# Altium schematic sheet WL-DAC.SchDoc
size 420 x 297 mm; Address1: Address1; Address2: Address2; Address3: Address3; Address4: Address4; DocumentNumber: ТРАНСИВЕР «ВОЛК»; SheetNumber: 5; Scale: 1:1; FirstReferrence: WOLF
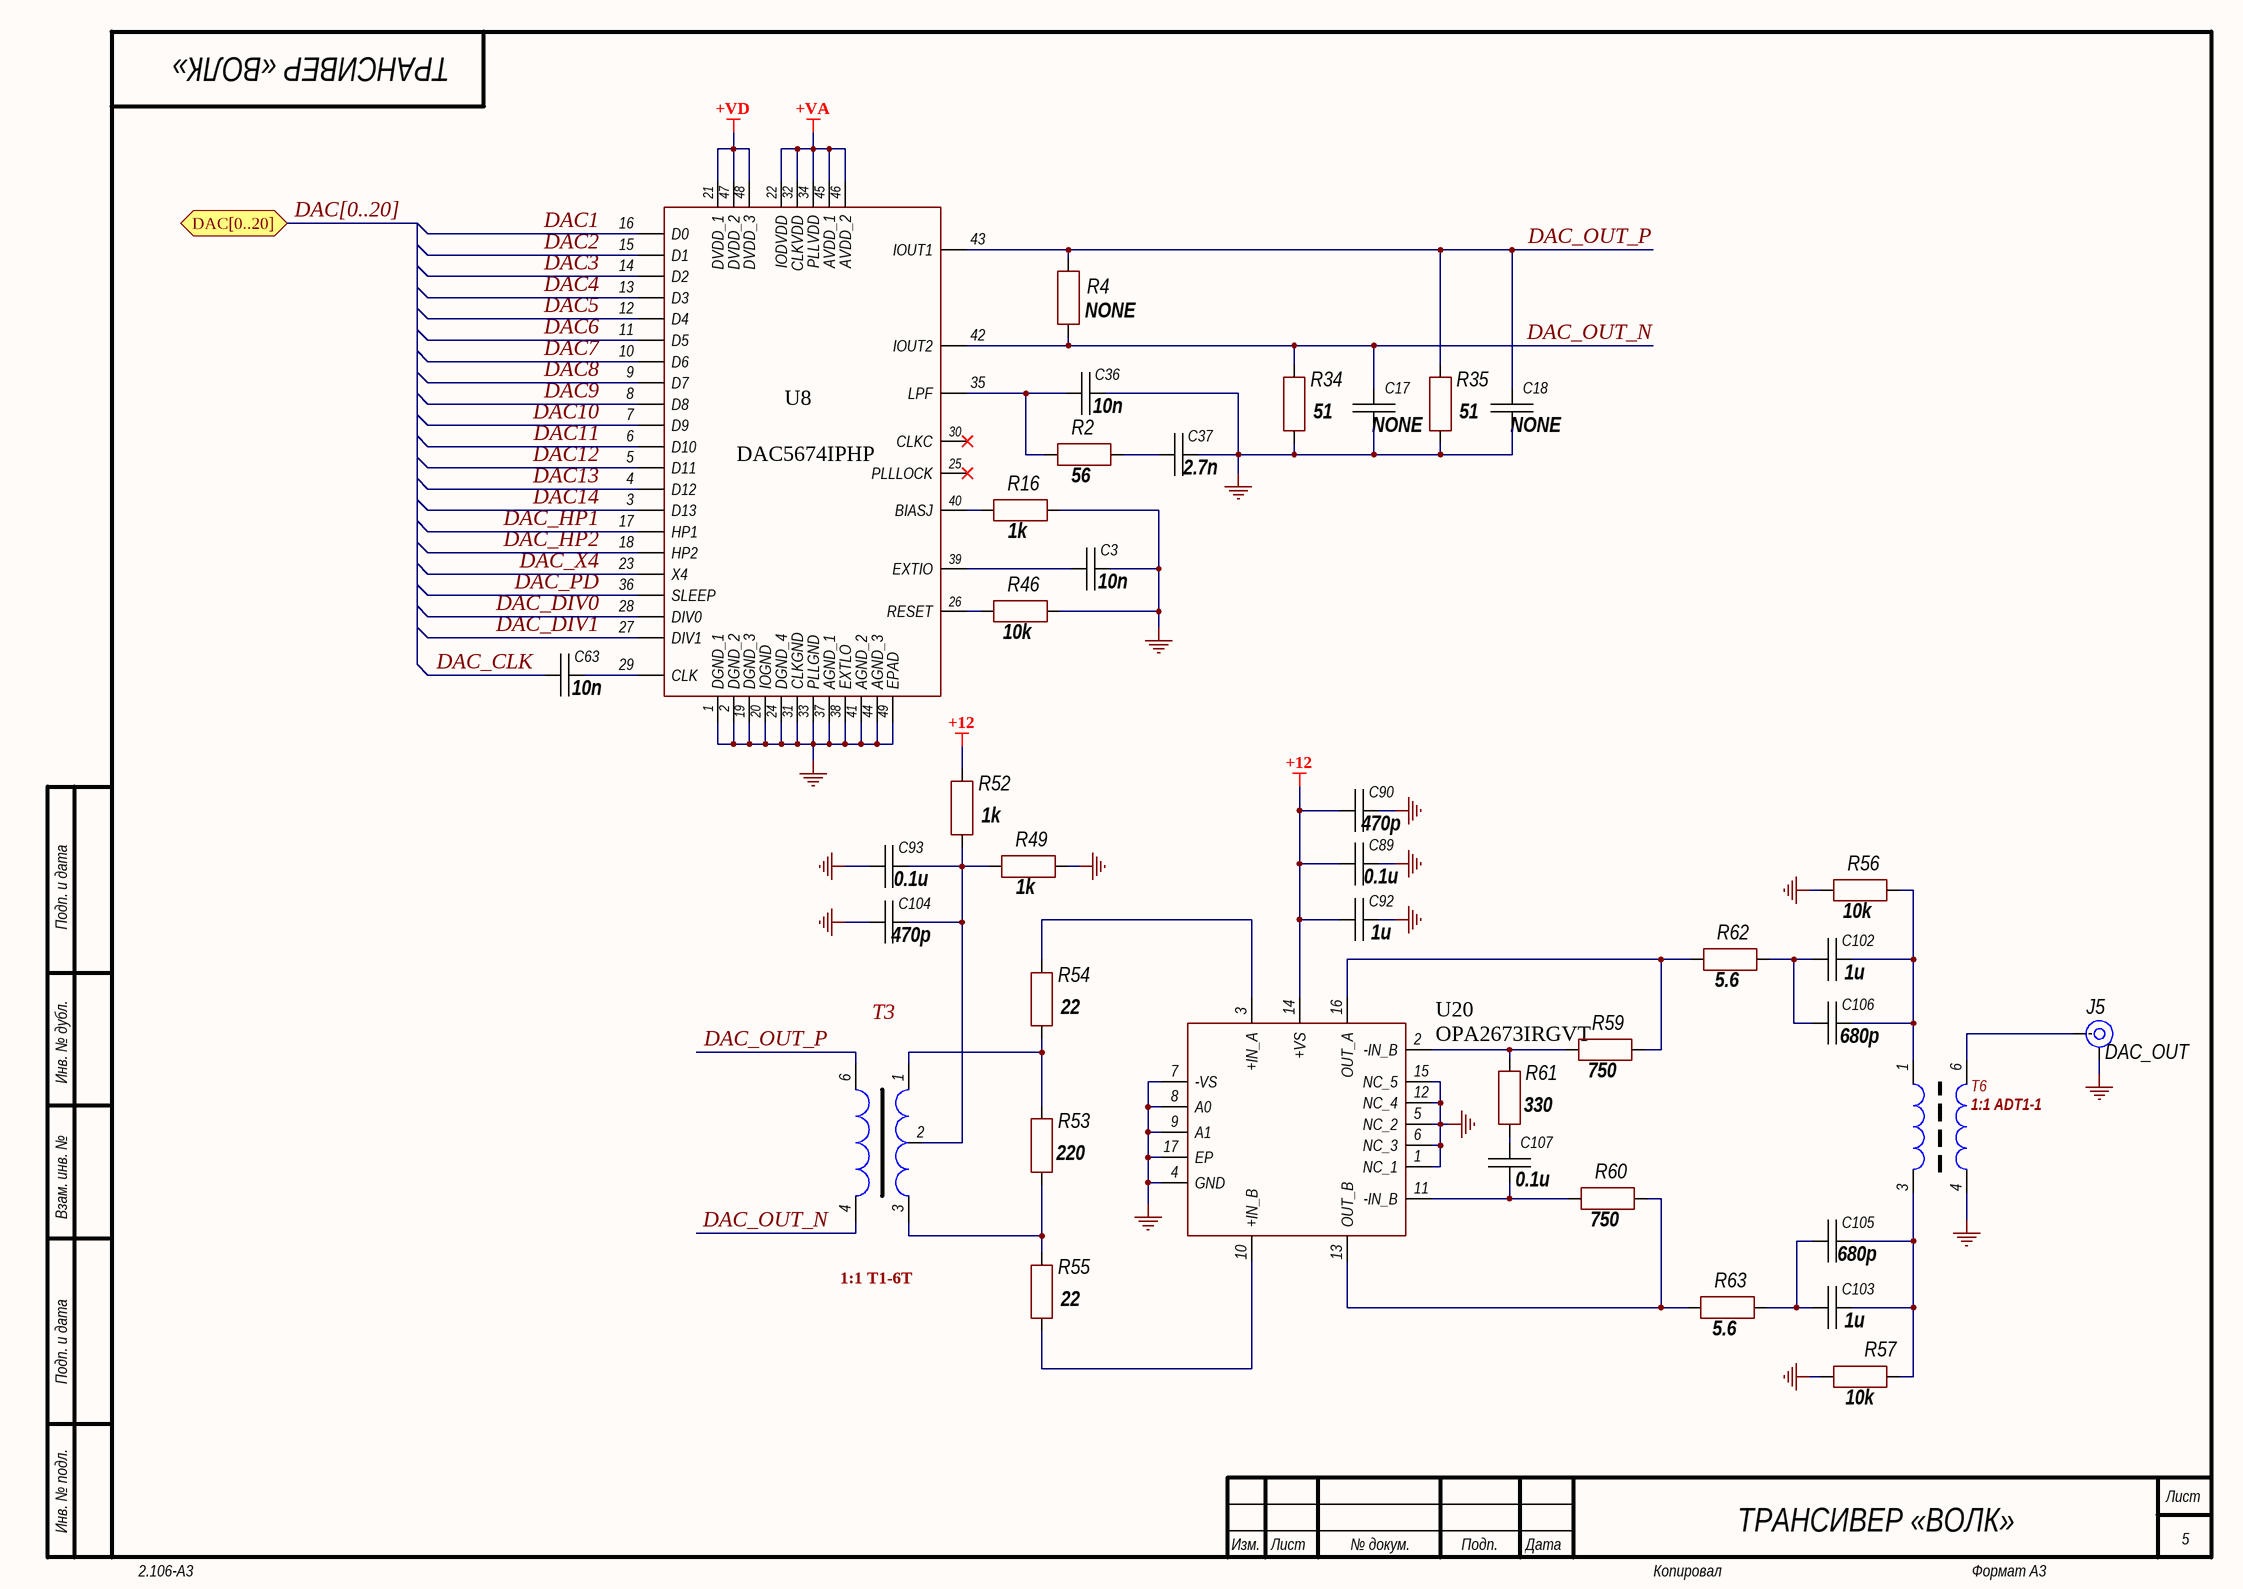
[diagram p0: WL-DAC.SchDoc]

## Parts
C3  10n  [CH0805C]
C17  NONE  [CH0805C]
C18  NONE  [CH0805C]
C36  10n  [CH0805C]
C37  2.7n  [CH0805C]
C63  10n  [CH0805C]
C89  0.1u  [CH0805C]
C90  470p  [CH0805C]
C92  1u  [CH0805C]
C93  0.1u  [CH0805C]
C102  1u  [CH0805C]
C103  1u  [CH0805C]
C104  470p  [CH0805C]
C105  680p  [CH0805C]
C106  680p  [CH0805C]
C107  0.1u  [CH0805C]
J5  DAC_OUT  [CON: SMA]
R2  56  [CH0805R]
R4  NONE  [CH0805R]
R16  1k  [CH0805R]
R34  51  [CH0805R]
R35  51  [CH0805R]
R46  10k  [CH0805R]
R49  1k  [CH0805R]
R52  1k  [CH0805R]
R53  220  [CH0805R]
R54  22  [CH0805R]
R55  22  [CH0805R]
R56  10k  [CH0805R]
R57  10k  [CH0805R]
R59  750  [CH0805R]
R60  750  [CH0805R]
R61  330  [CH0805R]
R62  5.6  [CH0805R]
R63  5.6  [CH0805R]
T3  1:1 T1-6T  [TC1-4]
T6  1:1 ADT1-1  [TC1-4]
U8  DAC5674IPHP  [48-TQFP]
U20  OPA2673IRGVT  [16-QFN 4x4 PAD17]

## Ports
DAC[0..20] (bidir)

## Nets
+12: C89.2 C90.2 C92.2 R52.1 U20.14(+VS)
+VA: U8.22(IODVDD) U8.32(CLKVDD) U8.34(PLLVDD) U8.45(AVDD_1) U8.46(AVDD_2)
+VD: U8.21(DVDD_1) U8.47(DVDD_2) U8.48(DVDD_3)
GND: C3.1 C17.2 C18.2 C36.1 C37.1 C89.1 C90.1 C92.1 C93.2 C104.2 J5.2(IN) R16.1 R34.2 R35.2 R46.1 R49.1 R56.2 R57.2 T6.4 U8.1(DGND_1) U8.2(DGND_2) U8.19(DGND_3) U8.20(IOGND) U8.24(DGND_4) U8.31(CLKGND) U8.33(PLLGND) U8.37(AGND_1) U8.38(EXTLO) U8.41(AGND_2) U8.44(AGND_3) U8.49(EPAD) U20.1(NC_1) U20.4(GND) U20.5(NC_2) U20.6(NC_3) U20.7(-VS) U20.8(A0) U20.9(A1) U20.12(NC_4) U20.15(NC_5) U20.17(EP)
DAC1: U8.16(D0)
DAC2: U8.15(D1)
DAC3: U8.14(D2)
DAC4: U8.13(D3)
DAC5: U8.12(D4)
DAC6: U8.11(D5)
DAC7: U8.10(D6)
DAC8: U8.9(D7)
DAC9: U8.8(D8)
DAC10: U8.7(D9)
DAC11: U8.6(D10)
DAC12: U8.5(D11)
DAC13: U8.4(D12)
DAC14: U8.3(D13)
DAC_CLK: C63.2
DAC_DIV0: U8.28(DIV0)
DAC_DIV1: U8.27(DIV1)
DAC_HP1: U8.17(HP1)
DAC_HP2: U8.18(HP2)
DAC_OUT_N: C17.1 R4.2 R34.1 T3.4 U8.42(IOUT2)
DAC_OUT_P: C18.1 R4.1 R35.1 T3.6 U8.43(IOUT1)
DAC_PD: U8.36(SLEEP)
DAC_X4: U8.23(X4)
NetC3_2: C3.2 U8.39(EXTIO)
NetC36_2: C36.2 R2.2 U8.35(LPF)
NetC37_2: C37.2 R2.1
NetC63_1: C63.1 U8.29(CLK)
NetC93_1: C93.1 C104.1 R49.2 R52.2 T3.2
NetC102_1: C102.1 C106.1 R56.1 T6.1
NetC102_2: C102.2 C106.2 R62.1
NetC103_1: C103.1 C105.1 R57.1 T6.3
NetC103_2: C103.2 C105.2 R63.1
NetC107_1: C107.1 R61.2
NetC107_2: C107.2 R60.2 U20.11(-IN_B)
NetJ5_1: J5.1(IN) T6.6
NetR16_2: R16.2 U8.40(BIASJ)
NetR46_2: R46.2 U8.26(RESET)
NetR53_1: R53.1 R54.2 T3.1
NetR53_2: R53.2 R55.1 T3.3
NetR54_1: R54.1 U20.3(+IN_A)
NetR55_2: R55.2 U20.10(+IN_B)
NetR59_1: R59.1 R62.2 U20.16(OUT_A)
NetR59_2: R59.2 R61.1 U20.2(-IN_B)
NetR60_1: R60.1 R63.2 U20.13(OUT_B)

Not connected (* = marked no-connect by the designer): U8 25(PLLLOCK)* 30(CLKC)*

## Buses and harness runs
bus DAC[0..20] = port DAC[0..20]

## Notes on the sheet
- Подп. и дата
- Инв. № дубл.
- Взам. инв. №
- Инв. № подл.
- Изм.
- Лист
- № докум.
- Подп.
- Дата
- 2.106-A3
- Копировал
- Формат А3

## Library data of the parts
C3 C17 C18 C36 C37 C63 C89 C90 C92 C93 C102-C107 = Capacitor: Manufacturer: *; Model: *; HelpURL: *; ComponentKind: *; Value: *
J5 = SMA: RF; Model: *; Manufacturer: *; HelpURL: *; ComponentKind: *
R2 R4 R16 R34 R35 R46 R49 R52-R57 R59-R63 = Resistor: Manufacturer: *; Model: *; HelpURL: *; ComponentKind: *; Value: *
T3 = TC4-1
T6 = BN-43-302